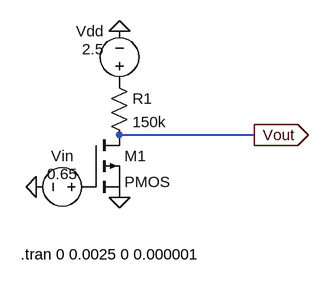
[diagram p0: schematic Lab 7 Fig 2f.asc]
Lab 7 Fig 2f.asc, the LTspice schematic file:
Version 4
SHEET 1 880 680
WIRE 288 160 80 160
FLAG 288 160 Vout
IOPIN 288 160 Out
FLAG 80 256 0
FLAG 80 0 0
FLAG -48 240 0
SYMBOL res 64 64 R0
SYMATTR InstName R1
SYMATTR Value 150k
SYMBOL pmos 32 160 R0
SYMATTR InstName M1
SYMBOL voltage 80 96 R180
WINDOW 0 24 96 Left 2
WINDOW 3 24 68 Left 2
WINDOW 123 0 0 Left 0
WINDOW 39 0 0 Left 0
SYMATTR InstName Vdd
SYMATTR Value 2.5
SYMBOL voltage 48 240 R90
WINDOW 0 -32 56 VBottom 2
WINDOW 3 -4 56 VBottom 2
WINDOW 123 0 0 Left 0
WINDOW 39 0 0 Left 0
SYMATTR InstName Vin
SYMATTR Value 0.65
TEXT -72 344 Left 2 !.tran 0 0.0025 0 0.000001

The netlist it stands for:
* Lab 7 Fig 2f.asc
R1 P001 Vout 150k
M1 Vout P002 0 0 PMOS
Vdd P001 0 2.5
Vin P002 0 0.65
.model NMOS NMOS
.model PMOS PMOS
.lib standard.mos
.tran 0 0.0025 0 0.000001
.backanno
.end